# Altium project PCBChamberRTDs.PrjPcb
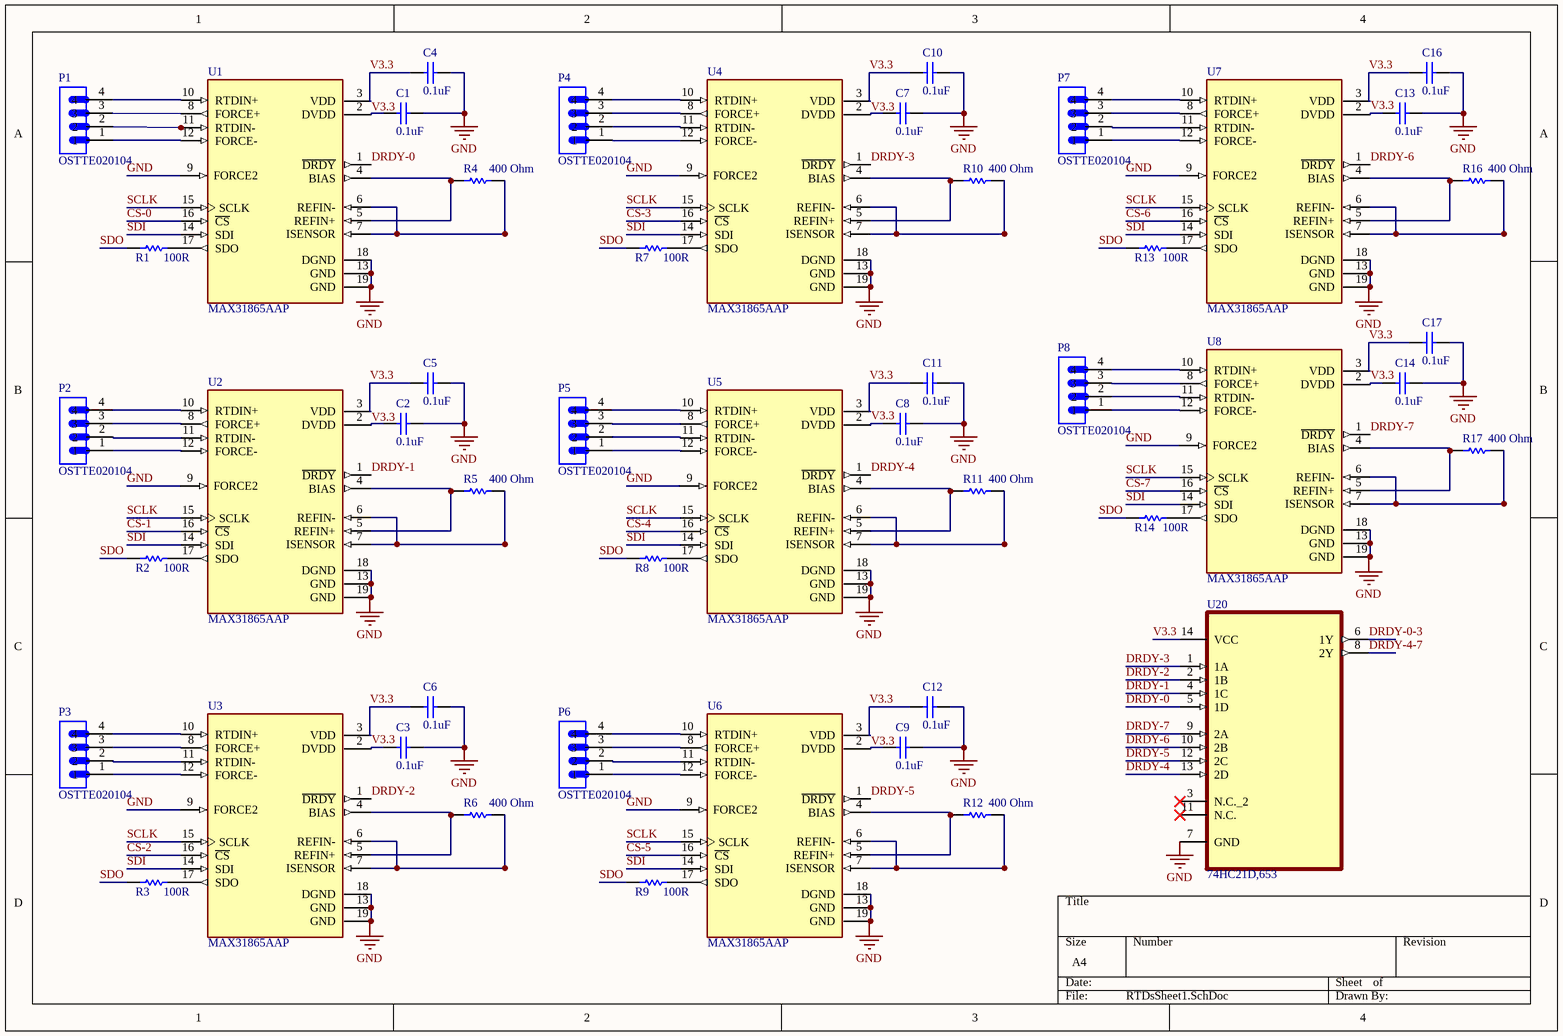
[diagram p0: RTDsSheet1.SchDoc]
3 sheets, 132 parts. Net scope: global (net labels, ports and power ports of the same name join across sheets).
Board file: PCBChamberRTDs.PcbDoc
Sheets:
  RTDsSheet1.SchDoc
  RTDsSheet2.SchDoc
  RTDsSheet3.SchDoc

## Sheet RTDsSheet1.SchDoc
size A4

### Parts
C1  value 0.1uF  [1608[0603]]
C2  value 0.1uF  [1608[0603]]
C3  value 0.1uF  [1608[0603]]
C4  value 0.1uF  [1608[0603]]
C5  value 0.1uF  [1608[0603]]
C6  value 0.1uF  [1608[0603]]
C7  value 0.1uF  [1608[0603]]
C8  value 0.1uF  [1608[0603]]
C9  value 0.1uF  [1608[0603]]
C10  value 0.1uF  [1608[0603]]
C11  value 0.1uF  [1608[0603]]
C12  value 0.1uF  [1608[0603]]
C13  value 0.1uF  [1608[0603]]
C14  value 0.1uF  [1608[0603]]
C16  value 0.1uF  [1608[0603]]
C17  value 0.1uF  [1608[0603]]
P1  OSTTE020104  [TE_3-641209-4]
P2  OSTTE020104  [TE_3-641209-4]
P3  OSTTE020104  [TE_3-641209-4]
P4  OSTTE020104  [TE_3-641209-4]
P5  OSTTE020104  [TE_3-641209-4]
P6  OSTTE020104  [TE_3-641209-4]
P7  OSTTE020104  [TE_3-641209-4]
P8  OSTTE020104  [TE_3-641209-4]
R1  value 100R  [1608[0603]]
R2  value 100R  [1608[0603]]
R3  value 100R  [1608[0603]]
R4  value 400 Ohm  [6-0805_M]
R5  value 400 Ohm  [6-0805_M]
R6  value 400 Ohm  [6-0805_M]
R7  value 100R  [1608[0603]]
R8  value 100R  [1608[0603]]
R9  value 100R  [1608[0603]]
R10  value 400 Ohm  [6-0805_M]
R11  value 400 Ohm  [6-0805_M]
R12  value 400 Ohm  [6-0805_M]
R13  value 100R  [1608[0603]]
R14  value 100R  [1608[0603]]
R16  value 400 Ohm  [6-0805_M]
R17  value 400 Ohm  [6-0805_M]
U1  MAX31865AAP  [SOP65P777X199-20N]
U2  MAX31865AAP  [SOP65P777X199-20N]
U3  MAX31865AAP  [SOP65P777X199-20N]
U4  MAX31865AAP  [SOP65P777X199-20N]
U5  MAX31865AAP  [SOP65P777X199-20N]
U6  MAX31865AAP  [SOP65P777X199-20N]
U7  MAX31865AAP  [SOP65P777X199-20N]
U8  MAX31865AAP  [SOP65P777X199-20N]
U20  74HC21D,653  [SOIC127P600X175-14N]

### Nets
GND: C1.1 C2.1 C3.1 C4.1 C5.1 C6.1 C7.1 C8.1 C9.1 C10.1 C11.1 C12.1 C13.1 C14.1 C16.1 C17.1 U1.9(FORCE2) U1.13(GND) U1.18(DGND) U1.19(GND) U2.9(FORCE2) U2.13(GND) U2.18(DGND) U2.19(GND) U3.9(FORCE2) U3.13(GND) U3.18(DGND) U3.19(GND) U4.9(FORCE2) U4.13(GND) U4.18(DGND) U4.19(GND) U5.9(FORCE2) U5.13(GND) U5.18(DGND) U5.19(GND) U6.9(FORCE2) U6.13(GND) U6.18(DGND) U6.19(GND) U7.9(FORCE2) U7.13(GND) U7.18(DGND) U7.19(GND) U8.9(FORCE2) U8.13(GND) U8.18(DGND) U8.19(GND) U20.7(GND)
CS-0: U1.16(~{CS})
CS-1: U2.16(~{CS})
CS-2: U3.16(~{CS})
CS-3: U4.16(~{CS})
CS-4: U5.16(~{CS})
CS-5: U6.16(~{CS})
CS-6: U7.16(~{CS})
CS-7: U8.16(~{CS})
DRDY-0: U1.1(~{DRDY}) U20.5(1D)
DRDY-0-3: U20.6(1Y)
DRDY-1: U2.1(~{DRDY}) U20.4(1C)
DRDY-2: U3.1(~{DRDY}) U20.2(1B)
DRDY-3: U4.1(~{DRDY}) U20.1(1A)
DRDY-4: U5.1(~{DRDY}) U20.13(2D)
DRDY-4-7: U20.8(2Y)
DRDY-5: U6.1(~{DRDY}) U20.12(2C)
DRDY-6: U7.1(~{DRDY}) U20.10(2B)
DRDY-7: U8.1(~{DRDY}) U20.9(2A)
SCLK: U1.15(SCLK) U2.15(SCLK) U3.15(SCLK) U4.15(SCLK) U5.15(SCLK) U6.15(SCLK) U7.15(SCLK) U8.15(SCLK)
SDI: U1.14(SDI) U2.14(SDI) U3.14(SDI) U4.14(SDI) U5.14(SDI) U6.14(SDI) U7.14(SDI) U8.14(SDI)
SDO: R1.2 R2.2 R3.2 R7.2 R8.2 R9.2 R13.2 R14.2
V3.3: C1.2 C2.2 C3.2 C4.2 C5.2 C6.2 C7.2 C8.2 C9.2 C10.2 C11.2 C12.2 C13.2 C14.2 C16.2 C17.2 U1.2(DVDD) U1.3(VDD) U2.2(DVDD) U2.3(VDD) U3.2(DVDD) U3.3(VDD) U4.2(DVDD) U4.3(VDD) U5.2(DVDD) U5.3(VDD) U6.2(DVDD) U6.3(VDD) U7.2(DVDD) U7.3(VDD) U8.2(DVDD) U8.3(VDD) U20.14(VCC)
NetP1_1: P1.1 U1.12(FORCE-)
NetP1_2: P1.2 U1.11(RTDIN-)
NetP1_3: P1.3 U1.8(FORCE+)
NetP1_4: P1.4 U1.10(RTDIN+)
NetP2_1: P2.1 U2.12(FORCE-)
NetP2_2: P2.2 U2.11(RTDIN-)
NetP2_3: P2.3 U2.8(FORCE+)
NetP2_4: P2.4 U2.10(RTDIN+)
NetP3_1: P3.1 U3.12(FORCE-)
NetP3_2: P3.2 U3.11(RTDIN-)
NetP3_3: P3.3 U3.8(FORCE+)
NetP3_4: P3.4 U3.10(RTDIN+)
NetP4_1: P4.1 U4.12(FORCE-)
NetP4_2: P4.2 U4.11(RTDIN-)
NetP4_3: P4.3 U4.8(FORCE+)
NetP4_4: P4.4 U4.10(RTDIN+)
NetP5_1: P5.1 U5.12(FORCE-)
NetP5_2: P5.2 U5.11(RTDIN-)
NetP5_3: P5.3 U5.8(FORCE+)
NetP5_4: P5.4 U5.10(RTDIN+)
NetP6_1: P6.1 U6.12(FORCE-)
NetP6_2: P6.2 U6.11(RTDIN-)
NetP6_3: P6.3 U6.8(FORCE+)
NetP6_4: P6.4 U6.10(RTDIN+)
NetP7_1: P7.1 U7.12(FORCE-)
NetP7_2: P7.2 U7.11(RTDIN-)
NetP7_3: P7.3 U7.8(FORCE+)
NetP7_4: P7.4 U7.10(RTDIN+)
NetP8_1: P8.1 U8.12(FORCE-)
NetP8_2: P8.2 U8.11(RTDIN-)
NetP8_3: P8.3 U8.8(FORCE+)
NetP8_4: P8.4 U8.10(RTDIN+)
NetR1_1: R1.1 U1.17(SDO)
NetR2_1: R2.1 U2.17(SDO)
NetR3_1: R3.1 U3.17(SDO)
NetR4_1: R4.1 U1.6(REFIN-) U1.7(ISENSOR)
NetR4_2: R4.2 U1.4(BIAS) U1.5(REFIN+)
NetR5_1: R5.1 U2.6(REFIN-) U2.7(ISENSOR)
NetR5_2: R5.2 U2.4(BIAS) U2.5(REFIN+)
NetR6_1: R6.1 U3.6(REFIN-) U3.7(ISENSOR)
NetR6_2: R6.2 U3.4(BIAS) U3.5(REFIN+)
NetR7_1: R7.1 U4.17(SDO)
NetR8_1: R8.1 U5.17(SDO)
NetR9_1: R9.1 U6.17(SDO)
NetR10_1: R10.1 U4.6(REFIN-) U4.7(ISENSOR)
NetR10_2: R10.2 U4.4(BIAS) U4.5(REFIN+)
NetR11_1: R11.1 U5.6(REFIN-) U5.7(ISENSOR)
NetR11_2: R11.2 U5.4(BIAS) U5.5(REFIN+)
NetR12_1: R12.1 U6.6(REFIN-) U6.7(ISENSOR)
NetR12_2: R12.2 U6.4(BIAS) U6.5(REFIN+)
NetR13_1: R13.1 U7.17(SDO)
NetR14_1: R14.1 U8.17(SDO)
NetR16_1: R16.1 U7.6(REFIN-) U7.7(ISENSOR)
NetR16_2: R16.2 U7.4(BIAS) U7.5(REFIN+)
NetR17_1: R17.1 U8.6(REFIN-) U8.7(ISENSOR)
NetR17_2: R17.2 U8.4(BIAS) U8.5(REFIN+)

Not connected (* = marked no-connect by the designer): U20 3(N.C._2)* 11(N.C.)*

### Library data of the parts
C1-C14 C16 C17 = Cap Semi: Capacitor (Semiconductor SIM Model); Published: 8-Jun-2000; LatestRevisionDate: 29-May-2009; LatestRevisionNote: IPC-7351 Footprint Added.; PackageReference: C1206; Publisher: Altium Limited; PackageDescription: Chip Capacitor
P1-P8 = OSTTE020104: Terminal Block 3.5mm 2pos Pcb; MF: {'manufacturer': u'On Shore'}; Availability: Unavailable; Package: None; MP: OSTTE020104; Value: *; Price: None
R1-R14 R16 R17 = Res Semi: Semiconductor Resistor; Published: 8-Jun-2000; LatestRevisionDate: 17-Jul-2002; LatestRevisionNote: Re-released for DXP Platform.; PackageReference: AXIAL-0.5; Publisher: Altium Limited; PackageDescription: Axial Device, Thru-Hole; 2 Leads; 0.5 in Pin Spacing
U1-U8 = MAX31865AAP: Rtd To Digital Converter In Ssop Tr; MF: {'manufacturer': u'Maxim Integrated'}; Availability: Unavailable; Package: None; MP: MAX31865AAP; Value: *; Price: None
U20 = 74HC21D,653: Dual 4-input AND gate; MF: {'manufacturer': u'Nexperia USA'}; Value: *; Availability: Unavailable; Price: None; Package: None; MP: 74HC21D,653

## Sheet RTDsSheet2.SchDoc
size A4
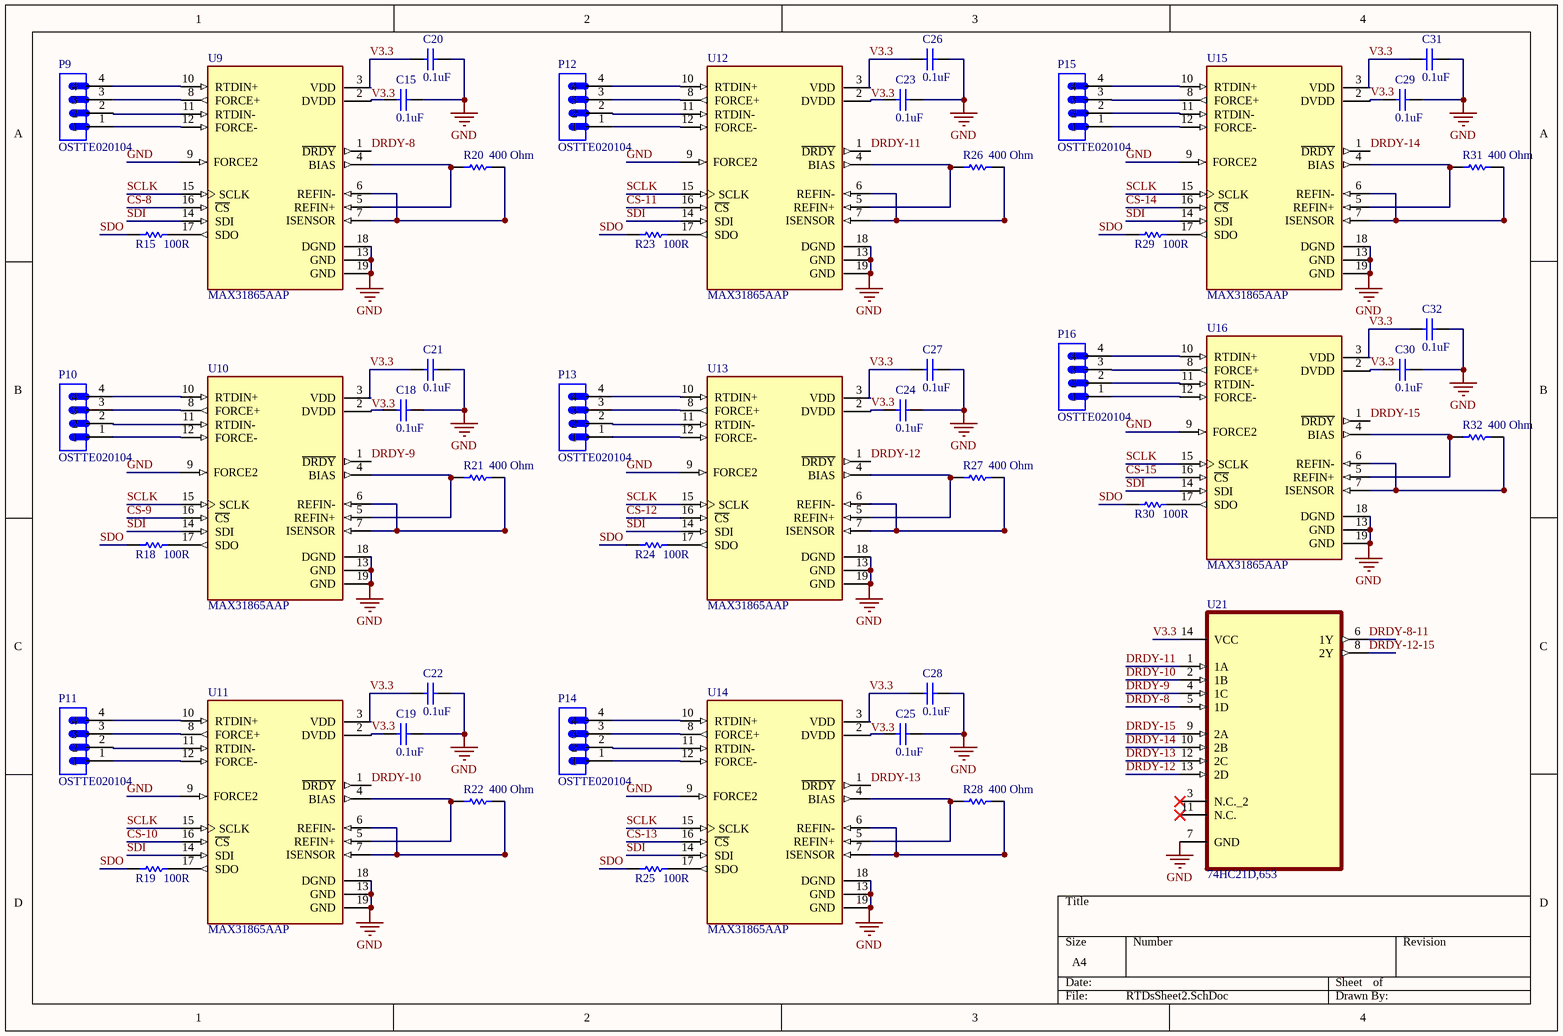
[diagram p1: RTDsSheet2.SchDoc]

### Parts
C15  value 0.1uF  [1608[0603]]
C18  value 0.1uF  [1608[0603]]
C19  value 0.1uF  [1608[0603]]
C20  value 0.1uF  [1608[0603]]
C21  value 0.1uF  [1608[0603]]
C22  value 0.1uF  [1608[0603]]
C23  value 0.1uF  [1608[0603]]
C24  value 0.1uF  [1608[0603]]
C25  value 0.1uF  [1608[0603]]
C26  value 0.1uF  [1608[0603]]
C27  value 0.1uF  [1608[0603]]
C28  value 0.1uF  [1608[0603]]
C29  value 0.1uF  [1608[0603]]
C30  value 0.1uF  [1608[0603]]
C31  value 0.1uF  [1608[0603]]
C32  value 0.1uF  [1608[0603]]
P9  OSTTE020104  [TE_3-641209-4]
P10  OSTTE020104  [TE_3-641209-4]
P11  OSTTE020104  [TE_3-641209-4]
P12  OSTTE020104  [TE_3-641209-4]
P13  OSTTE020104  [TE_3-641209-4]
P14  OSTTE020104  [TE_3-641209-4]
P15  OSTTE020104  [TE_3-641209-4]
P16  OSTTE020104  [TE_3-641209-4]
R15  value 100R  [1608[0603]]
R18  value 100R  [1608[0603]]
R19  value 100R  [1608[0603]]
R20  value 400 Ohm  [6-0805_M]
R21  value 400 Ohm  [6-0805_M]
R22  value 400 Ohm  [6-0805_M]
R23  value 100R  [1608[0603]]
R24  value 100R  [1608[0603]]
R25  value 100R  [1608[0603]]
R26  value 400 Ohm  [6-0805_M]
R27  value 400 Ohm  [6-0805_M]
R28  value 400 Ohm  [6-0805_M]
R29  value 100R  [1608[0603]]
R30  value 100R  [1608[0603]]
R31  value 400 Ohm  [6-0805_M]
R32  value 400 Ohm  [6-0805_M]
U9  MAX31865AAP  [SOP65P777X199-20N]
U10  MAX31865AAP  [SOP65P777X199-20N]
U11  MAX31865AAP  [SOP65P777X199-20N]
U12  MAX31865AAP  [SOP65P777X199-20N]
U13  MAX31865AAP  [SOP65P777X199-20N]
U14  MAX31865AAP  [SOP65P777X199-20N]
U15  MAX31865AAP  [SOP65P777X199-20N]
U16  MAX31865AAP  [SOP65P777X199-20N]
U21  74HC21D,653  [SOIC127P600X175-14N]

### Nets
GND: C15.1 C18.1 C19.1 C20.1 C21.1 C22.1 C23.1 C24.1 C25.1 C26.1 C27.1 C28.1 C29.1 C30.1 C31.1 C32.1 U9.9(FORCE2) U9.13(GND) U9.18(DGND) U9.19(GND) U10.9(FORCE2) U10.13(GND) U10.18(DGND) U10.19(GND) U11.9(FORCE2) U11.13(GND) U11.18(DGND) U11.19(GND) U12.9(FORCE2) U12.13(GND) U12.18(DGND) U12.19(GND) U13.9(FORCE2) U13.13(GND) U13.18(DGND) U13.19(GND) U14.9(FORCE2) U14.13(GND) U14.18(DGND) U14.19(GND) U15.9(FORCE2) U15.13(GND) U15.18(DGND) U15.19(GND) U16.9(FORCE2) U16.13(GND) U16.18(DGND) U16.19(GND) U21.7(GND)
CS-8: U9.16(~{CS})
CS-9: U10.16(~{CS})
CS-10: U11.16(~{CS})
CS-11: U12.16(~{CS})
CS-12: U13.16(~{CS})
CS-13: U14.16(~{CS})
CS-14: U15.16(~{CS})
CS-15: U16.16(~{CS})
DRDY-8: U9.1(~{DRDY}) U21.5(1D)
DRDY-8-11: U21.6(1Y)
DRDY-9: U10.1(~{DRDY}) U21.4(1C)
DRDY-10: U11.1(~{DRDY}) U21.2(1B)
DRDY-11: U12.1(~{DRDY}) U21.1(1A)
DRDY-12: U13.1(~{DRDY}) U21.13(2D)
DRDY-12-15: U21.8(2Y)
DRDY-13: U14.1(~{DRDY}) U21.12(2C)
DRDY-14: U15.1(~{DRDY}) U21.10(2B)
DRDY-15: U16.1(~{DRDY}) U21.9(2A)
SCLK: U9.15(SCLK) U10.15(SCLK) U11.15(SCLK) U12.15(SCLK) U13.15(SCLK) U14.15(SCLK) U15.15(SCLK) U16.15(SCLK)
SDI: U9.14(SDI) U10.14(SDI) U11.14(SDI) U12.14(SDI) U13.14(SDI) U14.14(SDI) U15.14(SDI) U16.14(SDI)
SDO: R15.2 R18.2 R19.2 R23.2 R24.2 R25.2 R29.2 R30.2
V3.3: C15.2 C18.2 C19.2 C20.2 C21.2 C22.2 C23.2 C24.2 C25.2 C26.2 C27.2 C28.2 C29.2 C30.2 C31.2 C32.2 U9.2(DVDD) U9.3(VDD) U10.2(DVDD) U10.3(VDD) U11.2(DVDD) U11.3(VDD) U12.2(DVDD) U12.3(VDD) U13.2(DVDD) U13.3(VDD) U14.2(DVDD) U14.3(VDD) U15.2(DVDD) U15.3(VDD) U16.2(DVDD) U16.3(VDD) U21.14(VCC)
NetP9_1: P9.1 U9.12(FORCE-)
NetP9_2: P9.2 U9.11(RTDIN-)
NetP9_3: P9.3 U9.8(FORCE+)
NetP9_4: P9.4 U9.10(RTDIN+)
NetP10_1: P10.1 U10.12(FORCE-)
NetP10_2: P10.2 U10.11(RTDIN-)
NetP10_3: P10.3 U10.8(FORCE+)
NetP10_4: P10.4 U10.10(RTDIN+)
NetP11_1: P11.1 U11.12(FORCE-)
NetP11_2: P11.2 U11.11(RTDIN-)
NetP11_3: P11.3 U11.8(FORCE+)
NetP11_4: P11.4 U11.10(RTDIN+)
NetP12_1: P12.1 U12.12(FORCE-)
NetP12_2: P12.2 U12.11(RTDIN-)
NetP12_3: P12.3 U12.8(FORCE+)
NetP12_4: P12.4 U12.10(RTDIN+)
NetP13_1: P13.1 U13.12(FORCE-)
NetP13_2: P13.2 U13.11(RTDIN-)
NetP13_3: P13.3 U13.8(FORCE+)
NetP13_4: P13.4 U13.10(RTDIN+)
NetP14_1: P14.1 U14.12(FORCE-)
NetP14_2: P14.2 U14.11(RTDIN-)
NetP14_3: P14.3 U14.8(FORCE+)
NetP14_4: P14.4 U14.10(RTDIN+)
NetP15_1: P15.1 U15.12(FORCE-)
NetP15_2: P15.2 U15.11(RTDIN-)
NetP15_3: P15.3 U15.8(FORCE+)
NetP15_4: P15.4 U15.10(RTDIN+)
NetP16_1: P16.1 U16.12(FORCE-)
NetP16_2: P16.2 U16.11(RTDIN-)
NetP16_3: P16.3 U16.8(FORCE+)
NetP16_4: P16.4 U16.10(RTDIN+)
NetR15_1: R15.1 U9.17(SDO)
NetR18_1: R18.1 U10.17(SDO)
NetR19_1: R19.1 U11.17(SDO)
NetR20_1: R20.1 U9.6(REFIN-) U9.7(ISENSOR)
NetR20_2: R20.2 U9.4(BIAS) U9.5(REFIN+)
NetR21_1: R21.1 U10.6(REFIN-) U10.7(ISENSOR)
NetR21_2: R21.2 U10.4(BIAS) U10.5(REFIN+)
NetR22_1: R22.1 U11.6(REFIN-) U11.7(ISENSOR)
NetR22_2: R22.2 U11.4(BIAS) U11.5(REFIN+)
NetR23_1: R23.1 U12.17(SDO)
NetR24_1: R24.1 U13.17(SDO)
NetR25_1: R25.1 U14.17(SDO)
NetR26_1: R26.1 U12.6(REFIN-) U12.7(ISENSOR)
NetR26_2: R26.2 U12.4(BIAS) U12.5(REFIN+)
NetR27_1: R27.1 U13.6(REFIN-) U13.7(ISENSOR)
NetR27_2: R27.2 U13.4(BIAS) U13.5(REFIN+)
NetR28_1: R28.1 U14.6(REFIN-) U14.7(ISENSOR)
NetR28_2: R28.2 U14.4(BIAS) U14.5(REFIN+)
NetR29_1: R29.1 U15.17(SDO)
NetR30_1: R30.1 U16.17(SDO)
NetR31_1: R31.1 U15.6(REFIN-) U15.7(ISENSOR)
NetR31_2: R31.2 U15.4(BIAS) U15.5(REFIN+)
NetR32_1: R32.1 U16.6(REFIN-) U16.7(ISENSOR)
NetR32_2: R32.2 U16.4(BIAS) U16.5(REFIN+)

Not connected (* = marked no-connect by the designer): U21 3(N.C._2)* 11(N.C.)*

### Library data of the parts
C15 C18-C32 = Cap Semi: Capacitor (Semiconductor SIM Model); Published: 8-Jun-2000; LatestRevisionDate: 29-May-2009; LatestRevisionNote: IPC-7351 Footprint Added.; PackageReference: C1206; Publisher: Altium Limited; PackageDescription: Chip Capacitor
P9-P16 = OSTTE020104: as P1 on sheet RTDsSheet1; Availability: Unavailable; Package: None; MP: OSTTE020104; Value: *; Price: None
R15 R18-R32 = Res Semi: Semiconductor Resistor; Published: 8-Jun-2000; LatestRevisionDate: 17-Jul-2002; LatestRevisionNote: Re-released for DXP Platform.; PackageReference: AXIAL-0.5; Publisher: Altium Limited; PackageDescription: Axial Device, Thru-Hole; 2 Leads; 0.5 in Pin Spacing
U9-U16 = MAX31865AAP: as U1 on sheet RTDsSheet1; Availability: Unavailable; Package: None; MP: MAX31865AAP; Value: *; Price: None
U21 = 74HC21D,653: as U20 on sheet RTDsSheet1; Value: *; Availability: Unavailable; Price: None; Package: None; MP: 74HC21D,653

## Sheet RTDsSheet3.SchDoc
size A4
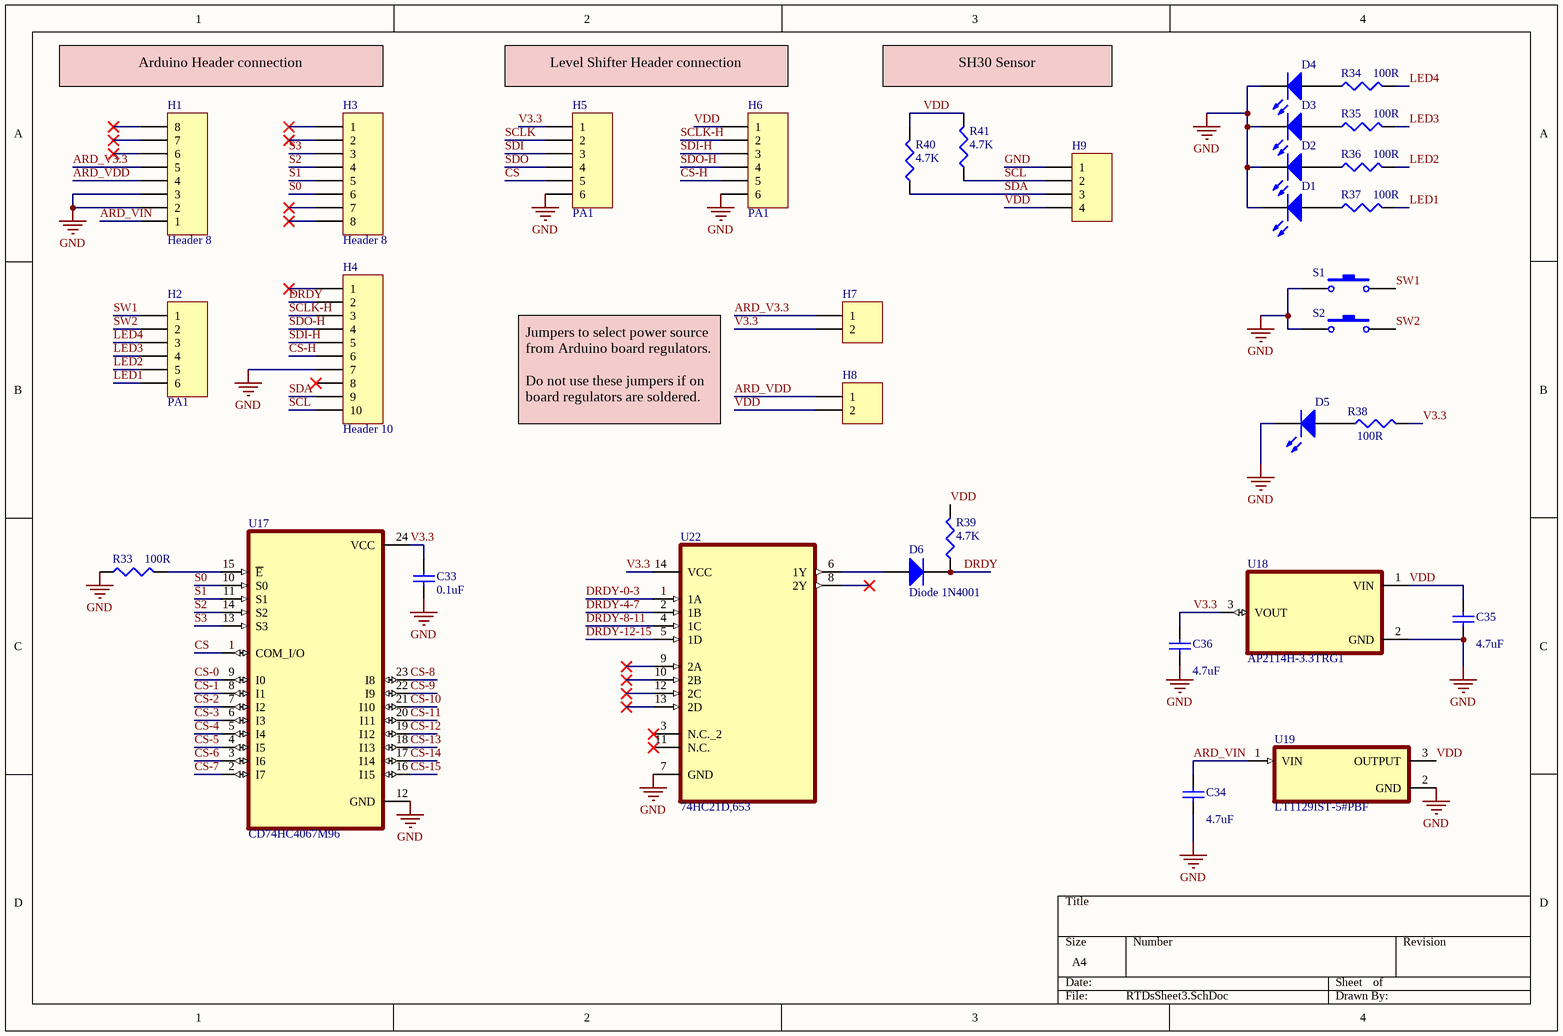
[diagram p2: RTDsSheet3.SchDoc]

### Parts
C33  value 0.1uF  [1608[0603]]
C34  value 4.7uF  [C0805]
C35  value 4.7uF  [C0805]
C36  value 4.7uF  [C0805]
D1  (no value)  [6-0805_N]
D2  (no value)  [6-0805_N]
D3  (no value)  [6-0805_N]
D4  (no value)  [6-0805_N]
D5  (no value)  [6-0805_N]
D6  Diode 1N4001  [C0805]
H1  Header 8  [HDR1X8]
H2  PA1  [HDR1X6]
H3  Header 8  [HDR1X8]
H4  Header 10  [HDR1X10]
H5  PA1  [HDR1X6]
H6  PA1  [HDR1X6]
H7  (no value)  [HDR1X2]
H8  (no value)  [HDR1X2]
H9  (no value)  [HDR1X4]
R33  value 100R  [J1-0603]
R34  value 100R  [J1-0603]
R35  value 100R  [J1-0603]
R36  value 100R  [J1-0603]
R37  value 100R  [J1-0603]
R38  value 100R  [J1-0603]
R39  value 4.7K  [J1-0603]
R40  value 4.7K  [J1-0603]
R41  value 4.7K  [J1-0603]
S1  (no value)  [PTS525SM08SMTR2LFS]
S2  (no value)  [PTS525SM08SMTR2LFS]
U17  CD74HC4067M96  [SOIC127P1030X265-24N]
U18  AP2114H-3.3TRG1  [SOT230P700X180-4N]
U19  LT1129IST-5#PBF  [SOT230P700X180-4N]
U22  74HC21D,653  [SOIC127P600X175-14N]

### Nets
GND: C33.2 C34.1 C35.1 C36.1 D1.2(K) D2.2(K) D3.2(K) D4.2(K) D5.2(K) H1.2 H1.3 H4.7 H5.6 H6.6 H9.1 R33.2 S1.1 S2.1 U17.12(GND) U18.2(GND) U19.2(GND) U22.7(GND)
ARD_V3.3: H1.5 H7.1
ARD_VDD: H1.4 H8.1
ARD_VIN: C34.2 H1.1 U19.1(VIN)
CS: H5.5 U17.1(COM_I/O)
CS-0: U17.9(I0)
CS-1: U17.8(I1)
CS-2: U17.7(I2)
CS-3: U17.6(I3)
CS-4: U17.5(I4)
CS-5: U17.4(I5)
CS-6: U17.3(I6)
CS-7: U17.2(I7)
CS-8: U17.23(I8)
CS-9: U17.22(I9)
CS-10: U17.21(I10)
CS-11: U17.20(I11)
CS-12: U17.19(I12)
CS-13: U17.18(I13)
CS-14: U17.17(I14)
CS-15: U17.16(I15)
CS-H: H4.6 H6.5
DRDY: D6.2(K) H4.2 R39.2
DRDY-0-3: U22.1(1A)
DRDY-4-7: U22.2(1B)
DRDY-8-11: U22.4(1C)
DRDY-12-15: U22.5(1D)
LED1: H2.6 R37.1
LED2: H2.5 R36.1
LED3: H2.4 R35.1
LED4: H2.3 R34.1
S0: H3.6 U17.10(S0)
S1: H3.5 U17.11(S1)
S2: H3.4 U17.14(S2)
S3: H3.3 U17.13(S3)
SCL: H4.10 H9.2 R41.2
SCLK: H5.2
SCLK-H: H4.3 H6.2
SDA: H4.9 H9.3 R40.2
SDI: H5.3
SDI-H: H4.5 H6.3
SDO: H5.4
SDO-H: H4.4 H6.4
SW1: H2.1 S1.2
SW2: H2.2 S2.2
V3.3: C33.1 C36.2 H5.1 H7.2 R38.1 U17.24(VCC) U18.3(VOUT) U22.14(VCC)
VDD: C35.2 H6.1 H8.2 H9.4 R39.1 R40.1 R41.1 U18.1(VIN) U19.3(OUTPUT)
NetD1_1: D1.1(A) R37.2
NetD2_1: D2.1(A) R36.2
NetD3_1: D3.1(A) R35.2
NetD4_1: D4.1(A) R34.2
NetD5_1: D5.1(A) R38.2
NetD6_1: D6.1(A) U22.6(1Y)
NetR33_1: R33.1 U17.15(~{E})

Not connected (* = marked no-connect by the designer): H1 6* 7* 8*; H3 1* 2* 7* 8*; H4 1* 8*; U22 3(N.C._2)* 8(2Y)* 9(2A)* 10(2B)* 11(N.C.)* 12(2C)* 13(2D)*

### Notes on the sheet
- Arduino Header connection
- Level Shifter Header connection
- SH30 Sensor
- Jumpers to select power source from Arduino board regulators.
  Do not use these jumpers if on board regulators are soldered.

### Library data of the parts
C33-C36 = Cap Semi: Capacitor (Semiconductor SIM Model); Published: 8-Jun-2000; LatestRevisionDate: 29-May-2009; LatestRevisionNote: IPC-7351 Footprint Added.; PackageReference: C1206; Publisher: Altium Limited; PackageDescription: Chip Capacitor
D1-D5 = LED3: Typical BLUE SiC LED; Published: 8-Jun-2000; LatestRevisionDate: 17-Dec-2003; LatestRevisionNote: PCB Footprint replaced.; DatasheetVersion: 16-Apr-2002; PackageVersion: 16-Apr-2002; PackageReference: 3.5X2.8X1.9; Publisher: Altium Limited; PackageDescription: SM LED; 2 C-Bend Leads; Body 3.5 x 2.8 x 1.9 mm, inc leads (LxWxH typ)
D6 = Diode 1N4001: 1 Amp General Purpose Rectifier; Published: 8-Jun-2000; LatestRevisionDate: 17-Jul-2002; LatestRevisionNote: Re-released for DXP Platform.; DatasheetVersion: 1998; PackageVersion: Aug-1999; PackageReference: DO-41; Publisher: Altium Limited; PackageDescription: Diode, Axial; Body 5.2 x 2.7 mm (LxDia. max), Lead Dia. 0.86 mm (max); Code_JEDEC: DO-204-AL; ComponentLink1Description: Manufacturer Link; ComponentLink1URL: http://www.fairchildsemi.com/; ComponentLink2Description: Datasheet; ComponentLink2URL: http://www.fairchildsemi.com/ds/1N%2F1N4001.pdf
H1 H3 = Header 8: Header, 8-Pin; LatestRevisionDate: 17-Jul-2002; LatestRevisionNote: Re-released for DXP Platform.; Publisher: Altium Limited
H2 H5 H6 = Header 6: Header, 6-Pin; LatestRevisionDate: 17-Jul-2002; LatestRevisionNote: Re-released for DXP Platform.; Publisher: Altium Limited
H4 = Header 10: Header, 10-Pin; LatestRevisionDate: 17-Jul-2002; LatestRevisionNote: Re-released for DXP Platform.; Publisher: Altium Limited
H7 H8 = Header 2: Header, 2-Pin; LatestRevisionDate: 17-Jul-2002; LatestRevisionNote: Re-released for DXP Platform.; Publisher: Altium Limited
H9 = Header 4: Header, 4-Pin; LatestRevisionDate: 17-Jul-2002; LatestRevisionNote: Re-released for DXP Platform.; Publisher: Altium Limited
R33-R41 = Res3: Resistor; Published: 8-Jun-2000; LatestRevisionDate: 29-May-2009; LatestRevisionNote: IPC-7351 Footprint Added.; PackageReference: J1-0603; Publisher: Altium Limited; PackageDescription: Chip Resistor
S1 S2 = SW-PB: Switch; Published: 24-Mar-1999; LatestRevisionDate: 17-Jul-2002; LatestRevisionNote: Re-released for DXP Platform.; PackageReference: SPST-2; Publisher: Altium Limited; PackageDescription: Switch; 2 Leads
U17 = CD74HC4067M96: MF: {'manufacturer': u'Texas Instruments'}; Value: *; Package: None; Price: None; MP: CD74HC4067M96; Availability: Unavailable
U18 = AP2114H-3.3TRG1: MF: {'manufacturer': u'Diodes Inc.'}; Price: None; Availability: Unavailable; Value: *; MP: AP2114H-3.3TRG1; Package: None
U19 = LT1129IST-5#PBF: MF: {'manufacturer': u'Analog Devices'}; Availability: Unavailable; Price: None; Value: *; MP: LT1129IST-5#PBF; Package: None
U22 = 74HC21D,653: as U20 on sheet RTDsSheet1; Value: *; Availability: Unavailable; Price: None; Package: None; MP: 74HC21D,653

## Nets that join several sheets
GND: RTDsSheet1 (49 pins), RTDsSheet2 (49 pins), RTDsSheet3 (22 pins)
CS-0: RTDsSheet1 (U1.16), RTDsSheet3 (U17.9)
CS-1: RTDsSheet1 (U2.16), RTDsSheet3 (U17.8)
CS-2: RTDsSheet1 (U3.16), RTDsSheet3 (U17.7)
CS-3: RTDsSheet1 (U4.16), RTDsSheet3 (U17.6)
CS-4: RTDsSheet1 (U5.16), RTDsSheet3 (U17.5)
CS-5: RTDsSheet1 (U6.16), RTDsSheet3 (U17.4)
CS-6: RTDsSheet1 (U7.16), RTDsSheet3 (U17.3)
CS-7: RTDsSheet1 (U8.16), RTDsSheet3 (U17.2)
CS-8: RTDsSheet2 (U9.16), RTDsSheet3 (U17.23)
CS-9: RTDsSheet2 (U10.16), RTDsSheet3 (U17.22)
CS-10: RTDsSheet2 (U11.16), RTDsSheet3 (U17.21)
CS-11: RTDsSheet2 (U12.16), RTDsSheet3 (U17.20)
CS-12: RTDsSheet2 (U13.16), RTDsSheet3 (U17.19)
CS-13: RTDsSheet2 (U14.16), RTDsSheet3 (U17.18)
CS-14: RTDsSheet2 (U15.16), RTDsSheet3 (U17.17)
CS-15: RTDsSheet2 (U16.16), RTDsSheet3 (U17.16)
DRDY-0-3: RTDsSheet1 (U20.6), RTDsSheet3 (U22.1)
DRDY-4-7: RTDsSheet1 (U20.8), RTDsSheet3 (U22.2)
DRDY-8-11: RTDsSheet2 (U21.6), RTDsSheet3 (U22.4)
DRDY-12-15: RTDsSheet2 (U21.8), RTDsSheet3 (U22.5)
SCLK: RTDsSheet1 (8 pins), RTDsSheet2 (8 pins), RTDsSheet3 (H5.2)
SDI: RTDsSheet1 (8 pins), RTDsSheet2 (8 pins), RTDsSheet3 (H5.3)
SDO: RTDsSheet1 (8 pins), RTDsSheet2 (8 pins), RTDsSheet3 (H5.4)
V3.3: RTDsSheet1 (33 pins), RTDsSheet2 (33 pins), RTDsSheet3 (8 pins)